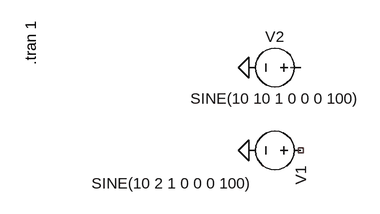
[diagram p0: schematic simple_subtract.asc]
simple_subtract.asc, the LTspice schematic file:
Version 4.1
SHEET 1 1948 756
WIRE 192 0 176 0
FLAG 112 128 0
FLAG 112 0 0
SYMBOL voltage 208 128 R90
WINDOW 3 51 91 VRight 2
WINDOW 123 0 0 Left 0
WINDOW 39 0 0 Left 0
SYMATTR InstName V1
SYMATTR Value SINE(10 2 1 0 0 0 100)
SYMBOL voltage 208 0 R90
WINDOW 0 -32 56 VBottom 2
WINDOW 3 32 56 VTop 2
WINDOW 123 0 0 Left 0
WINDOW 39 0 0 Left 0
SYMATTR InstName V2
SYMATTR Value SINE(10 10 1 0 0 0 100)
TEXT -224 -72 VRight 2 !.tran 1

The netlist it stands for:
* simple_subtract.asc
V1 NC_01 0 SINE(10 2 1 0 0 0 100)
V2 N001 0 SINE(10 10 1 0 0 0 100)
.tran 1
.backanno
.end